# EAGLE design powerStage (EAGLE 9.5.1)
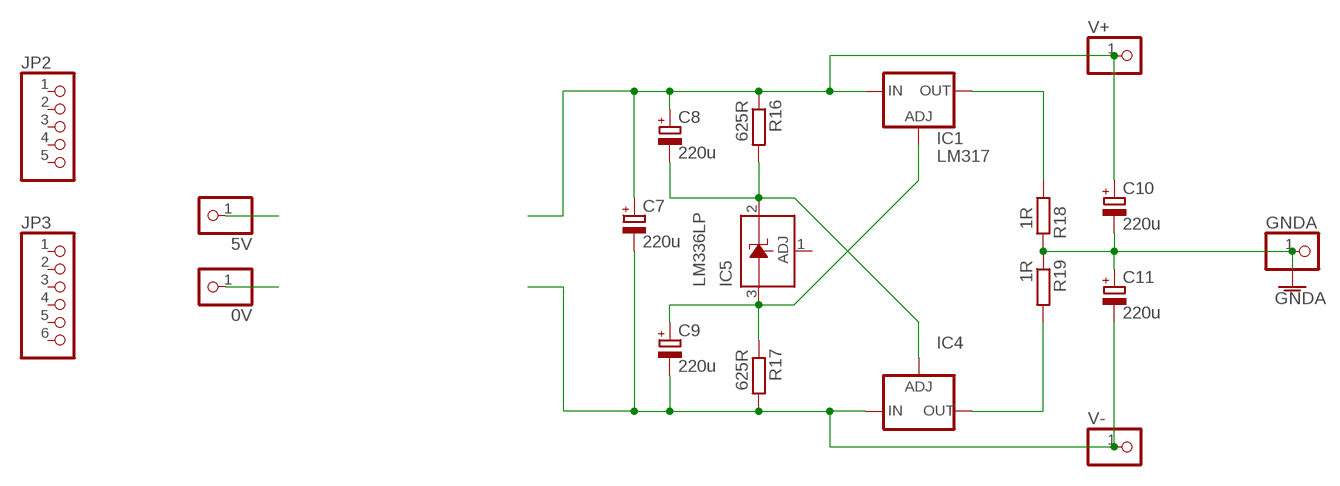
[diagram p0: schematic, sheet 1]

## Parts
0V  PINHD-1X1  [1X01]
5V  PINHD-1X1  [1X01]
C7  220u  CPOL-EUE2-5  [E2-5]
C8  220u  CPOL-EUE2-5  [E2-5]
C9  220u  CPOL-EUE2-5  [E2-5]
C10  220u  CPOL-EUE2-5  [E2-5]
C11  220u  CPOL-EUE2-5  [E2-5]
GNDA  PINHD-1X1  [1X01]
IC1  LM317  LM317MB  [TO220L1]
IC4  LM337TL  [337TL]
IC5  LM336LP  [TO92]
JP2  PINHD-1X5  [1X05]
JP3  PINHD-1X6  [1X06]
R16  625R  R-EU_0207/7  [0207/7]
R17  625R  R-EU_0207/7  [0207/7]
R18  1R  R-EU_0207/7  [0207/7]
R19  1R  R-EU_0207/7  [0207/7]
V+  PINHD-1X1  [1X01]
V-  PINHD-1X1  [1X01]

## Nets
GNDA: C10.- C11.+ GNDA.1 R18.2 R19.1
N$1: C7.+ C8.+ C10.+ IC1.3(IN) R16.1 V+.1
N$2: C7.- C9.- C11.- IC4.2(IN) R17.2 V-.1
N$3: 5V.1
N$4: 0V.1
N$18: C9.+ IC1.1(ADJ) IC5.3(A) R17.1
N$19: C8.- IC4.1(ADJ) IC5.2(C) R16.2
N$20: IC1.2(OUT) R18.1
N$21: IC4.3(OUT) R19.2
Unconnected: IC5.1(ADJ) JP2.1 JP2.2 JP2.3 JP2.4 JP2.5 JP3.1 JP3.2 JP3.3 JP3.4 JP3.5 JP3.6

## Library data of the parts
0V 5V GNDA V+ V- = pinhead:PINHD-1X1: PIN HEADER
C7-C11 = rcl:CPOL-EU: POLARIZED CAPACITOR, European symbol; SPICEPREFIX: C
IC1 = v-reg:LM317?*: 500 mA Adjustable Output Positive Voltage Regulator Source: http://www.onsemi.co.jp .. LM317M-D.PDF
IC4 = v-reg:LM337TL: VOLTAGE REGULATOR
IC5 = linear:LM336: 2.5-V INTEGRATED REFERENCE CIRCUITS LM236 Source: http://focus.ti.com/lit/ds/symlink/lm336-2.5.pdf
JP2 = pinhead:PINHD-1X5: PIN HEADER
JP3 = pinhead:PINHD-1X6: PIN HEADER
R16-R19 = rcl:R-EU_: RESISTOR, European symbol; SPICEPREFIX: R

## Net classes
0 default: width 0.2 mm, drill 0.7 mm, clearance 0.1 mm

## Board
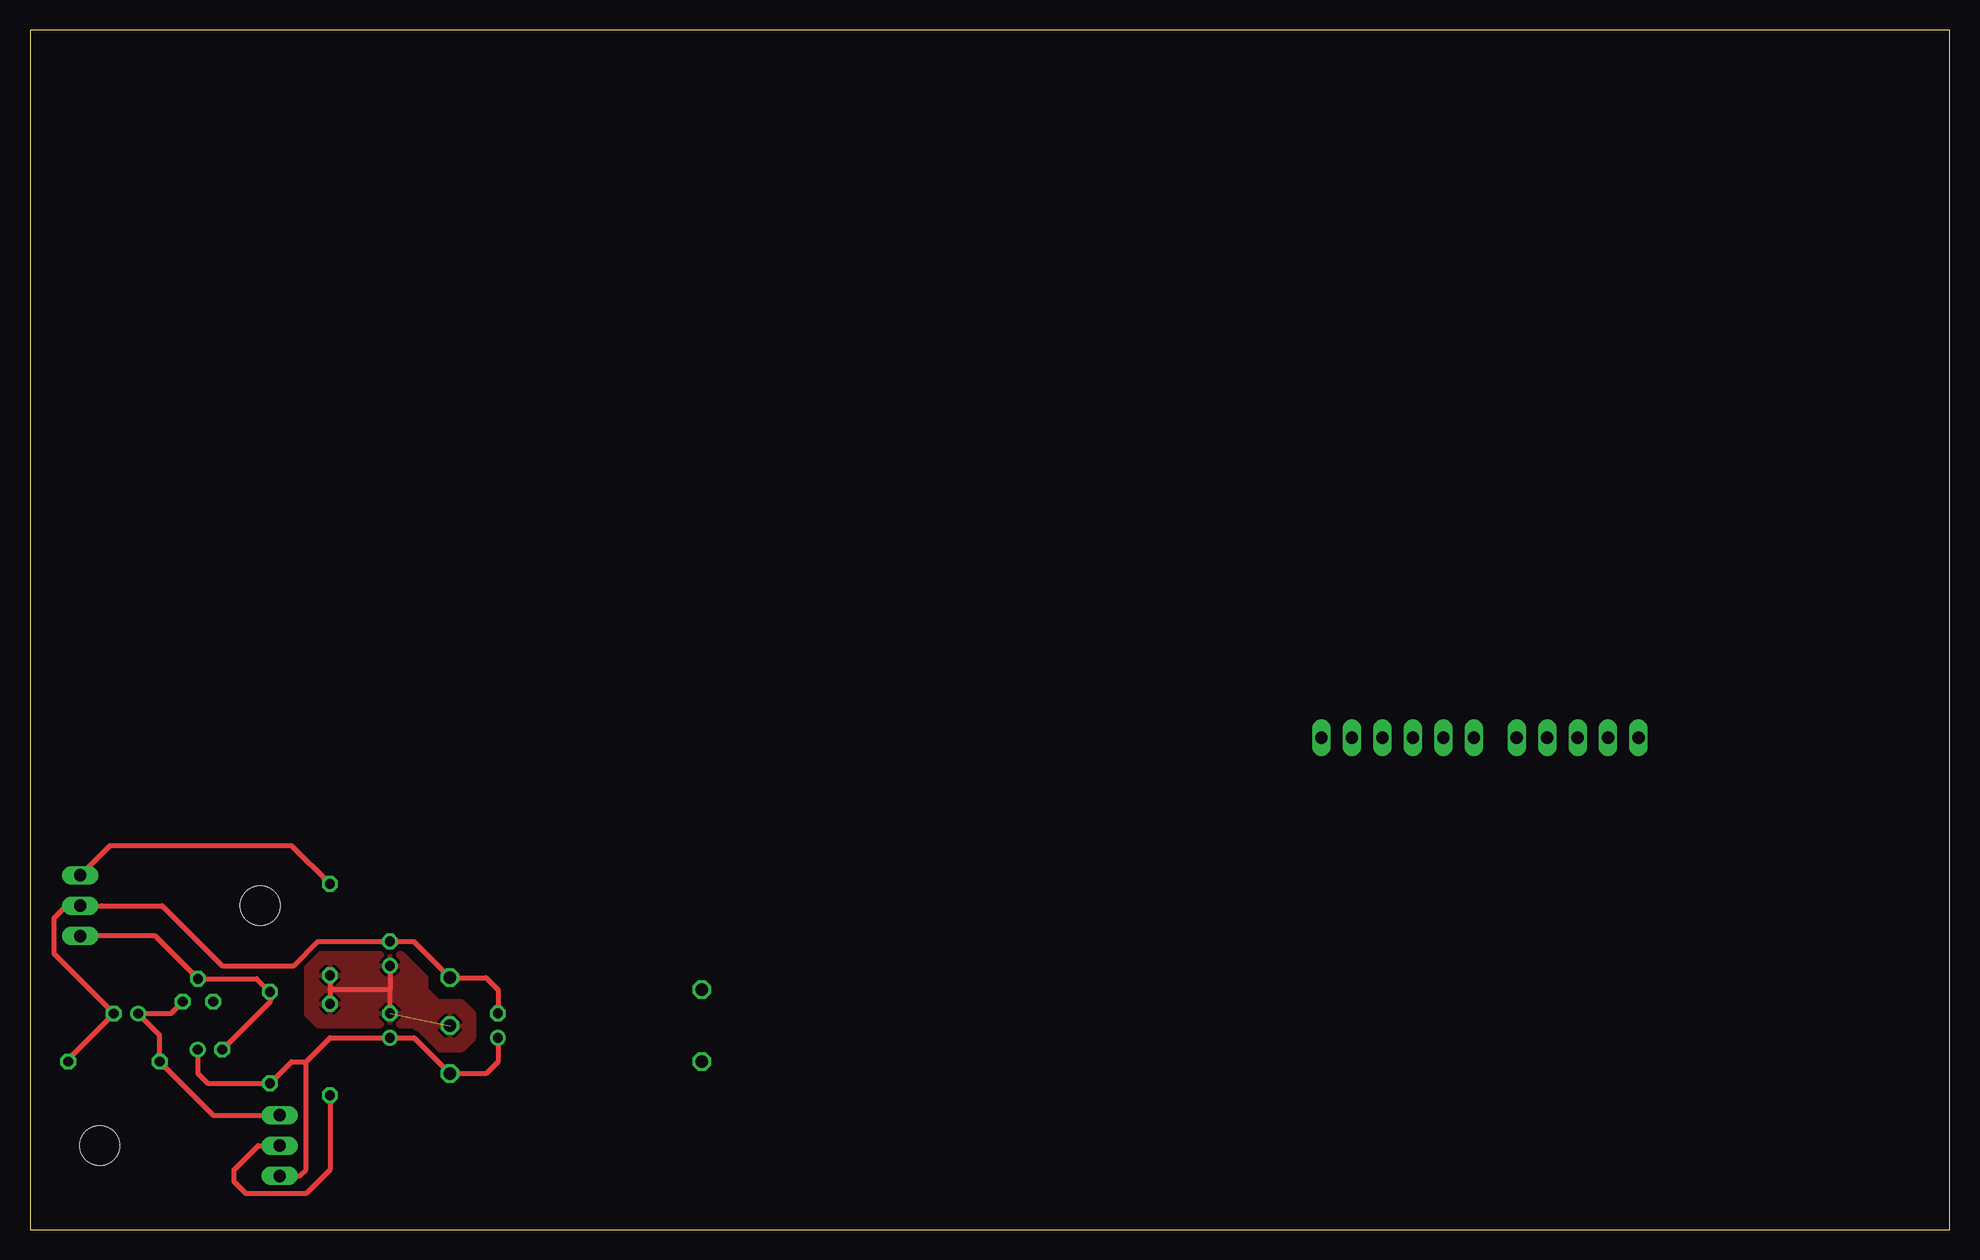
[diagram p1: board, top side]
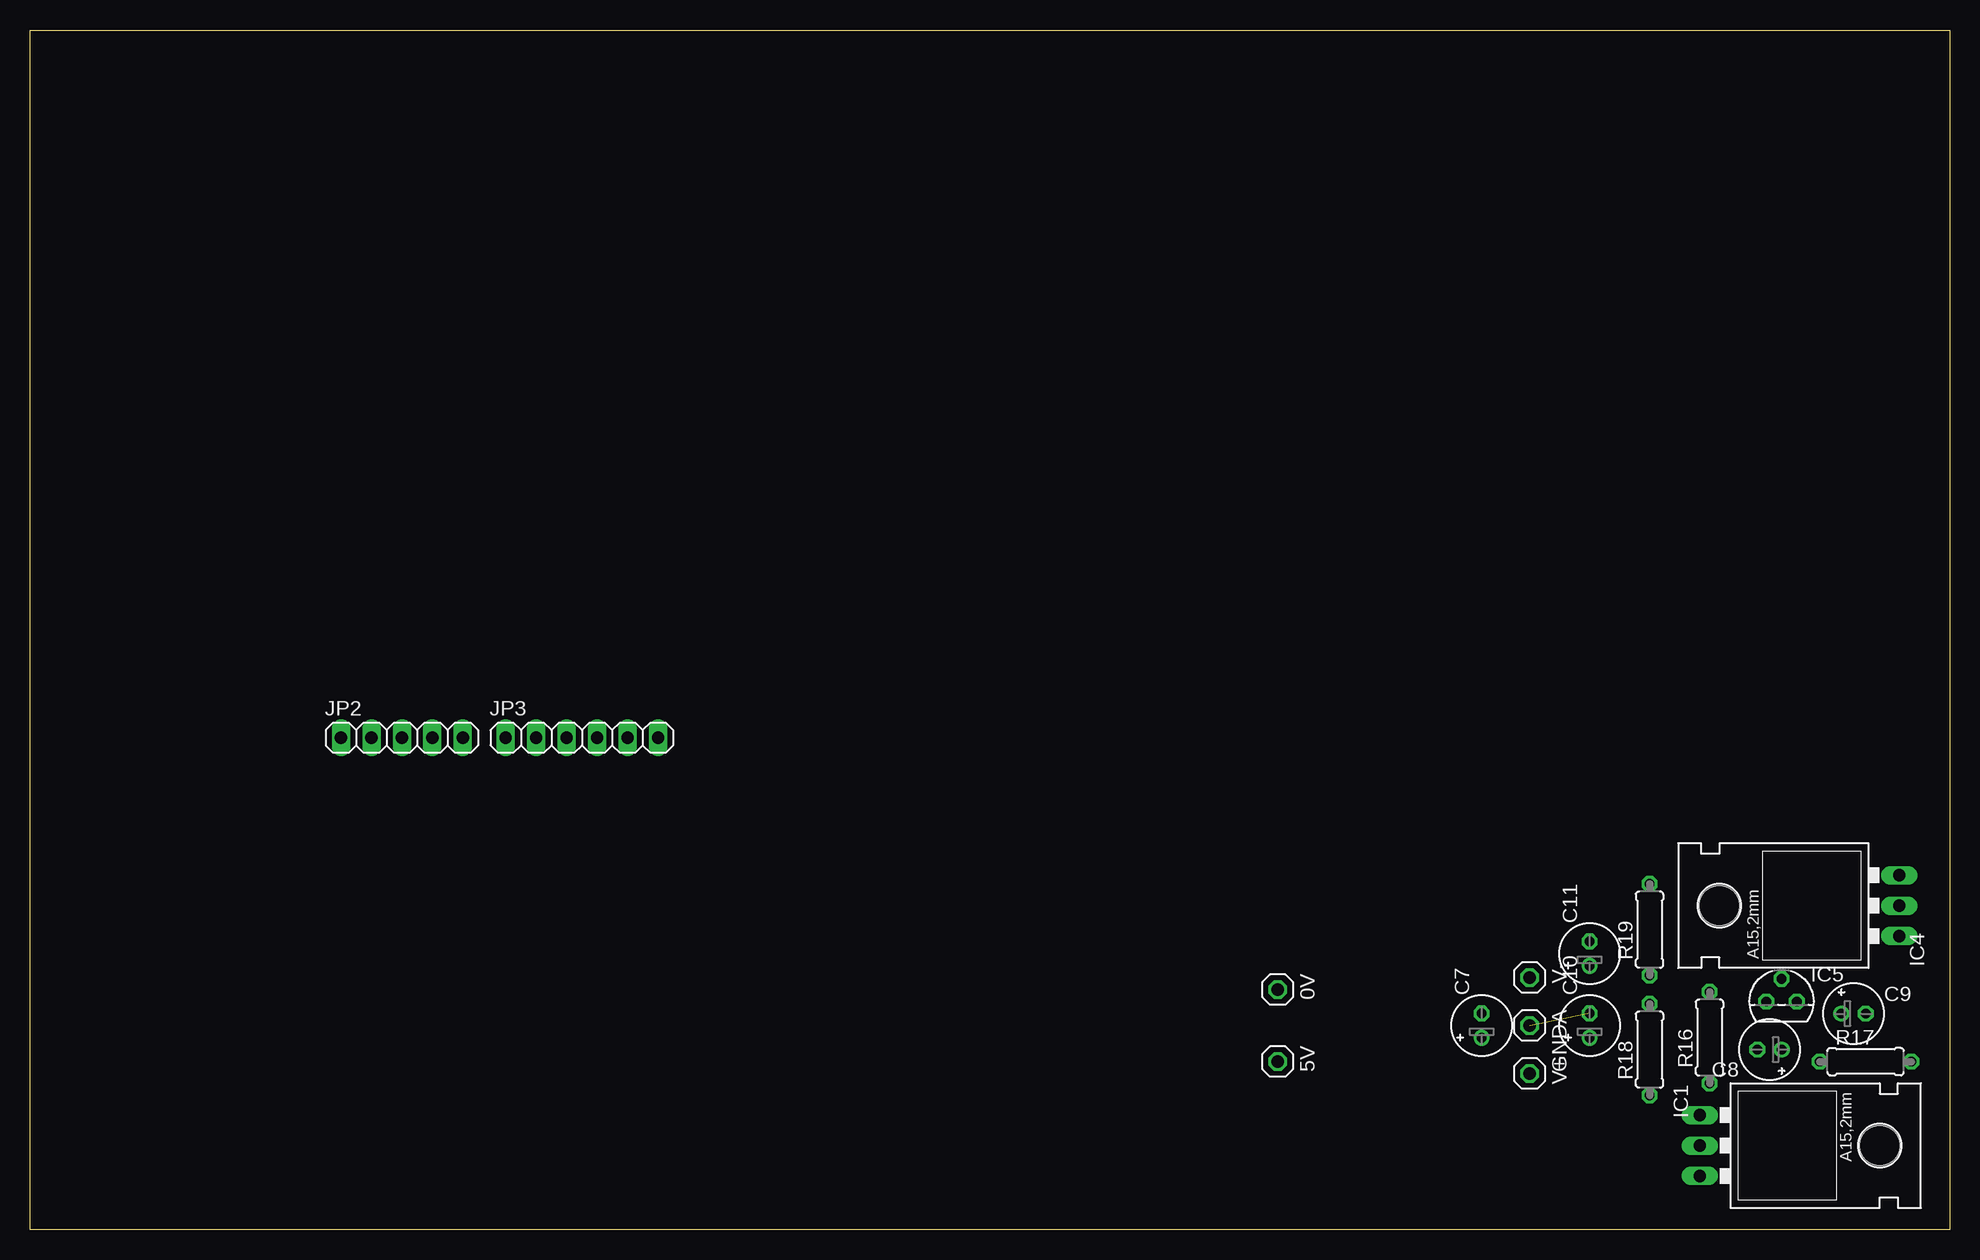
[diagram p2: board, bottom side, seen from below]

Size 160 x 100 mm. Coordinates in mm from the lower left corner, seen from the top.
Outline: 0,0 160,0 160,100 0,100 0,0
Copper layers (1*16): Top 0.035mm / dielectric 1.5mm / Bottom 0.035mm
Design rules "default *": minimum track width 0.4mm, minimum drill 0.35mm, track to track 0.4mm, track to pad 0.4mm, pad to pad 0.4mm, via to via 0.4mm, smd to smd 0.4mm, copper to edge 40mil, drill to drill 6mil, minimum pad ring 10mil, minimum via ring 8mil, stop-mask expansion 4mil, vias tented up to drill 0mil, thermal gap 10mil

### Footprints (pad centres in the part's own frame; a part is rotated, then mirrored left to right if it is on the bottom)
1X01 = drill 1.016 octagon: 1 0,0
E2-5 = drill 0.813 pad 1.27: + -1.016,0 | drill 0.813 pad 1.27 octagon: - 1.016,0
TO220L1 = drill 1.016 long: 1 -2.54,-3.81; 2 0,-3.81; 3 2.54,-3.81 | hole 3.302: 0,11.176
337TL = drill 1.016 long: 1 -2.54,-3.81; 2 0,-3.81; 3 2.54,-3.81 | hole 3.302: 0,11.176
TO92 = drill 0.813 octagon: 1 -1.27,0; 2 0,1.905; 3 1.27,0
1X05 = drill 1.016 long: 1 -5.08,0; 2 -2.54,0; 3 0,0; 4 2.54,0; 5 5.08,0
1X06 = drill 1.016 long: 1 -6.35,0; 2 -3.81,0; 3 -1.27,0; 4 1.27,0; 5 3.81,0; 6 6.35,0
0207/7 = drill 0.813 octagon: 1 -3.81,0; 2 3.81,0

### Placement (x,y rotation side)
0V  56,20 270 bottom
5V  56,14 270 bottom
C7  39,17 90 bottom
C8  15,15 180 bottom
C9  8,18 0 bottom
C10  30,17 90 bottom
C11  30,23 90 bottom
GNDA  35,17 270 bottom
IC1  17,7 270 bottom
IC4  8,27 90 bottom
IC5  14,19 0 bottom
JP2  129,41 0 bottom
JP3  114,41 0 bottom
R16  20,16 90 bottom
R17  7,14 0 bottom
R18  25,15 90 bottom
R19  25,25 90 bottom
V+  35,13 270 bottom
V-  35,21 270 bottom

### Tracks (layer width: path | path; a pad name or v marks a point on that pad's centre or on a via)
GNDA  (1 unrouted)
  Top 0.4: R19.1 25,20 | 25,20 R18.2 | 30,20 25,20 | C11.+ 30,20 | C10.- 30,20
  pour Top: 36,19 34,19 33,20 33,21 31,23 24,23 23,22 23,18 24,17 32,17 34,15 36,15 37,16 37,18
N$1
  Top 0.4: IC1.3 22.46,4.46 23,5 23,13.98 | 24.98,15.98 25,15.98 | 25,15.98 C10.+ 32.02,15.98 V+.1 38,13 39,14 C7.+ | C8.+ 13.98,13.02 14.81,12.19 R16.1 21.79,13.98 23,13.98 | 23,13.98 25,15.98
N$2
  Top 0.4: IC4.2 6,27 | R17.2 3.19,14.21 C9.- 6.98,18.02 2,23 2,26 3,27 IC4.2 | IC4.2 11,27 16,22 22,22 24.02,24.02 C11.- 31.98,24.02 V-.1 38,21 39,20 C7.-
N$18
  Top 0.4: IC5.3 11.73,18 C9.+ 10.81,16.21 R17.1 15.27,9.54 IC1.1
N$19
  Top 0.4: 5.35,24.46 IC4.1 10.45,24.46 IC5.2 18.91,20.91 R16.2 | 20.17,19.81 R16.2 | R16.2 20,18.98 C8.-
N$20
  Top 0.4: R18.1 25,5 23,3 18,3 17,4 17,5 19,7 IC1.2
N$21
  Top 0.4: R19.2 21.81,32 6.65,32 IC4.3